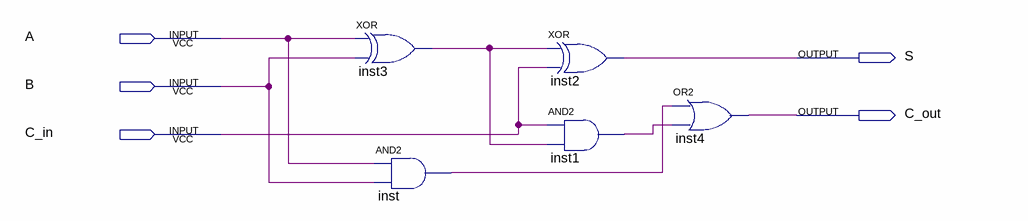
[diagram p0: schematic sheet]
// Quartus schematic Full_adder.bdf as structural Verilog: 5 symbols, 5 pins
module Full_adder (
  input  A,
  input  B,
  input  C_in,
  output S,
  output C_out
);

  wire inst1_out, inst3_out, inst_out;

  xor inst3 (inst3_out, A, B);
  and inst (inst_out, A, B);
  xor inst2 (S, inst3_out, C_in);
  and inst1 (inst1_out, C_in, inst3_out);
  or inst4 (C_out, inst_out, inst1_out);
endmodule
